# Altium schematic sheet entrée_sortie.SchDoc
size A4; SheetNumber: 3; SheetTotal: 4
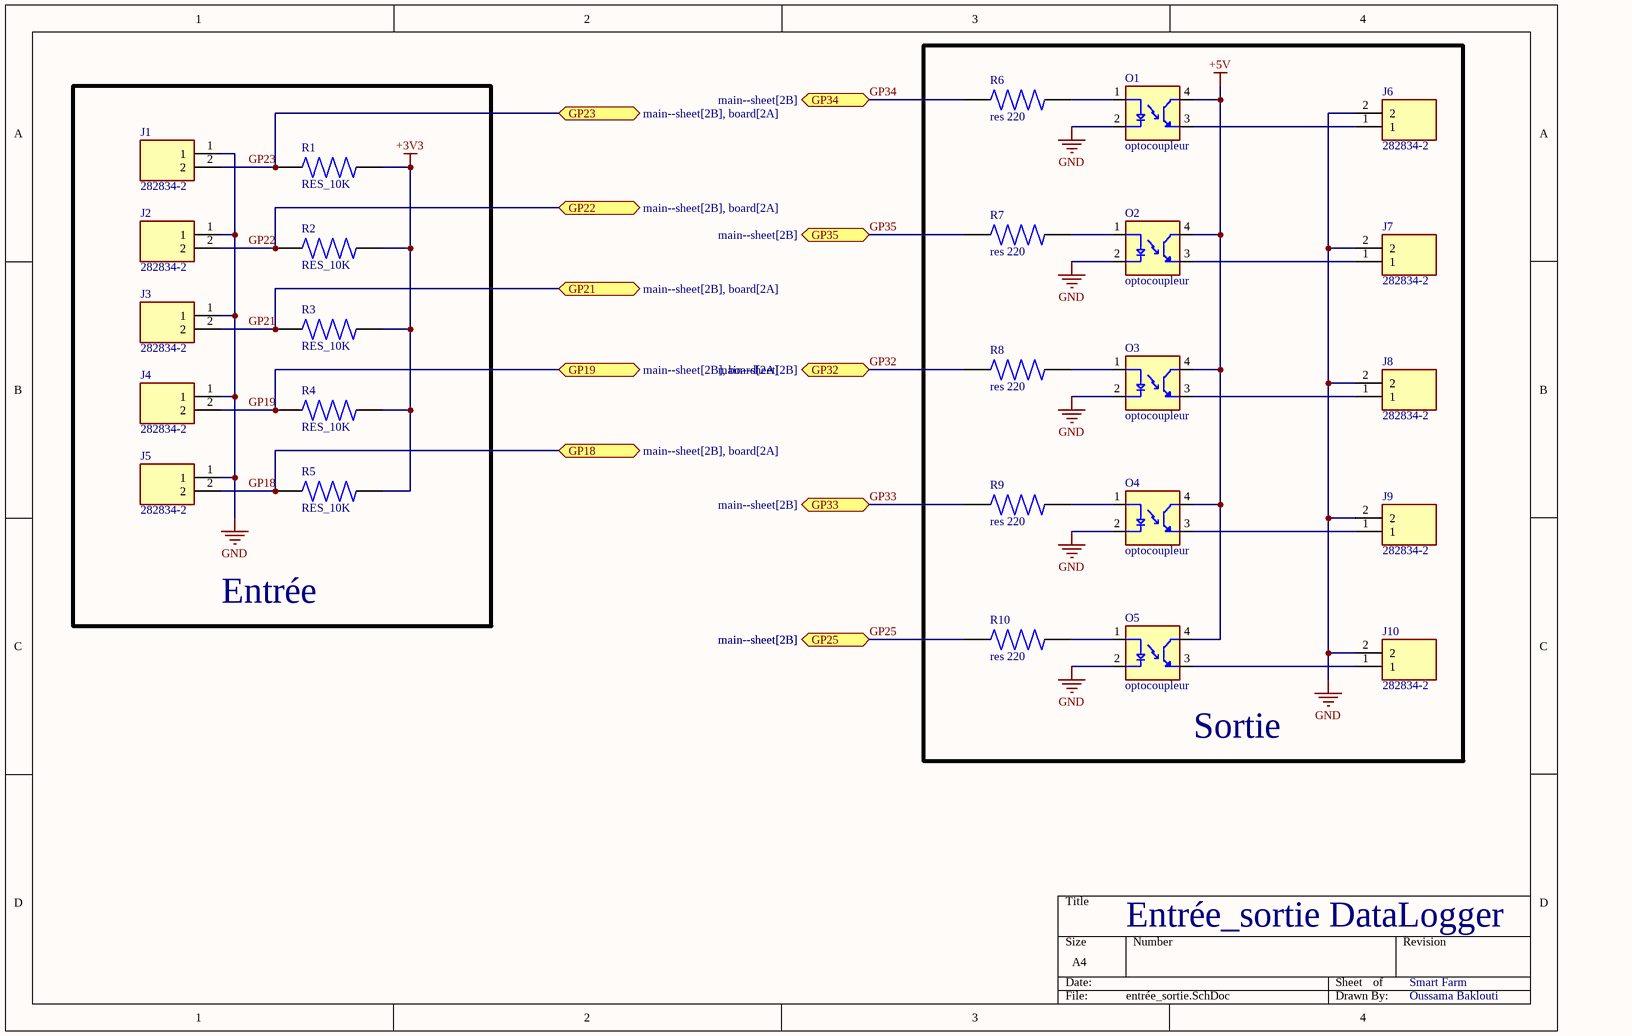
[diagram p0: entrée_sortie.SchDoc]

## Parts
J1  282834-2  [282834-2]
J2  282834-2  [282834-2]
J3  282834-2  [282834-2]
J4  282834-2  [282834-2]
J5  282834-2  [282834-2]
J6  282834-2  [282834-2]
J7  282834-2  [282834-2]
J8  282834-2  [282834-2]
J9  282834-2  [282834-2]
J10  282834-2  [282834-2]
O1  optocoupleur  [optocoupleur]
O2  optocoupleur  [optocoupleur]
O3  optocoupleur  [optocoupleur]
O4  optocoupleur  [optocoupleur]
O5  optocoupleur  [optocoupleur]
R1  RES_10K  [RES_10k]
R2  RES_10K  [RES_10k]
R3  RES_10K  [RES_10k]
R4  RES_10K  [RES_10k]
R5  RES_10K  [RES_10k]
R6  res 220  [res 220]
R7  res 220  [res 220]
R8  res 220  [res 220]
R9  res 220  [res 220]
R10  res 220  [res 220]

## Blocks framed on the sheet
Entrée: J1-J5 R1-R5
Sortie: J6-J10 O1-O5 R6-R10

## Ports
GP18 (bidir, see main--sheet[2B], board[2A]), GP19 (bidir, see main--sheet[2B], board[2A]), GP21 (bidir, see main--sheet[2B], board[2A]), GP22 (bidir, see main--sheet[2B], board[2A]), GP23 (bidir, see main--sheet[2B], board[2A]), GP25 (bidir, see main--sheet[2B]), GP32 (bidir, see main--sheet[2B]), GP33 (bidir, see main--sheet[2B]), GP34 (bidir, see main--sheet[2B]), GP35 (bidir, see main--sheet[2B])

## Nets
+3V3: R1.2 R2.2 R3.2 R4.2 R5.2
+5V: O1.4(CT) O2.4(CT) O3.4(CT) O4.4(CT) O5.4(CT)
GND: J1.1 J2.1 J3.1 J4.1 J5.1 J6.2 J7.2 J8.2 J9.2 J10.2 O1.2(C) O2.2(C) O3.2(C) O4.2(C) O5.2(C)
GP18: J5.2 R5.1 ; port GP18
GP19: J4.2 R4.1 ; port GP19
GP21: J3.2 R3.1 ; port GP21
GP22: J2.2 R2.1 ; port GP22
GP23: J1.2 R1.1 ; port GP23
GP25: R10.1 ; port GP25
GP32: R8.1 ; port GP32
GP33: R9.1 ; port GP33
GP34: R6.1 ; port GP34
GP35: R7.1 ; port GP35
NetJ6_1: J6.1 O1.3(ET)
NetJ7_1: J7.1 O2.3(ET)
NetJ8_1: J8.1 O3.3(ET)
NetJ9_1: J9.1 O4.3(ET)
NetJ10_1: J10.1 O5.3(ET)
NetO1_1: O1.1(A) R6.2
NetO2_1: O2.1(A) R7.2
NetO3_1: O3.1(A) R8.2
NetO4_1: O4.1(A) R9.2
NetO5_1: O5.1(A) R10.2

## Notes on the sheet
- Entrée_sortie DataLogger
- Smart Farm
- Oussama Baklouti

## Library data of the parts
J1-J10 = 282834-2: MF: {'manufacturer': u'TE Connectivity'}; Value: *; MP: 282834-2; Availability: Unavailable; Package: None; Price: None